# Altium schematic sheet LC79D.SchDoc
size A4; SheetNumber: 1; SheetTotal: 3
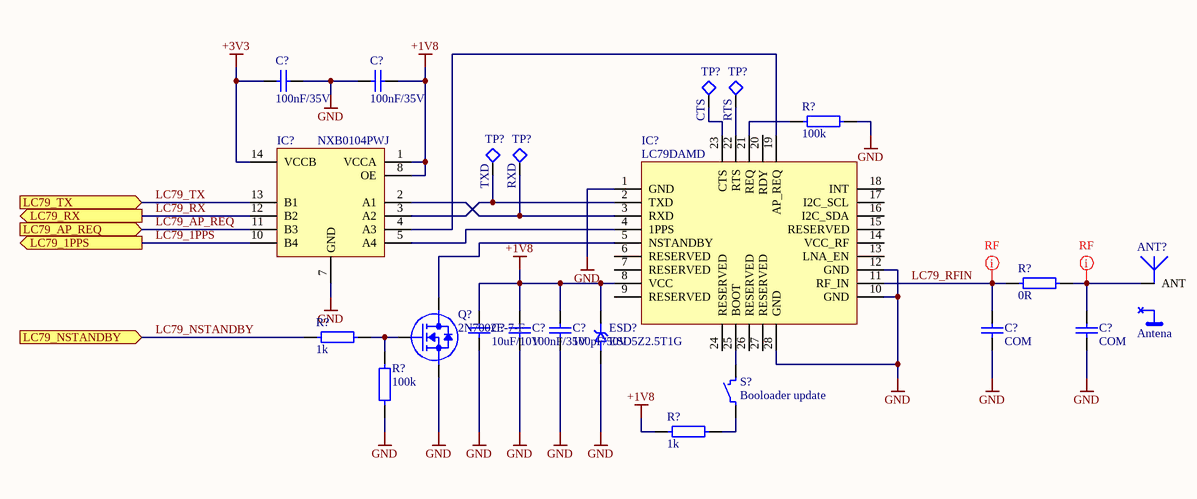
[diagram p0: LC79D.SchDoc]

## Parts
(Parts that share a designator on the sheet are numbered #1, #2 ... from top to bottom, then left to right.)
ANT?  Antena  [2116240001]
C?#1  100nF/35V  [C0603]
C?#2  100nF/35V  [C0603]
C?#3  10uF/10V  [C0603]
C?#4  100nF/35V  [C0603]
C?#5  COM  [C0603]
C?#6  COM  [C0603]
C?#7  100pF/50V  [C0603]
ESD?  ESD5Z2.5T1G  [SOD523]
IC?#1  NXB0104PWJ  [TSSOP14]
IC?#2  LC79DAMD  [GPS1010-28P]
Q?  2N7002E-7-F  [SOT23-3]
R?#1  100k  [R0603]
R?#2  0R  [R0603]
R?#3  1k  [R0603]
R?#4  100k  [R0603]
R?#5  1k  [R0603]
S?  Booloader update  [PTS636SMT]
TP?#1  CTS  [TP_SMD_S0.5]  (no BOM)
TP?#2  RTS  [TP_SMD_S0.5]  (no BOM)
TP?#3  TXD  [TP_SMD_S0.5]  (no BOM)
TP?#4  RXD  [TP_SMD_S0.5]  (no BOM)

## Ports
LC79_1PPS (out), LC79_AP_REQ (in), LC79_NSTANDBY (in), LC79_RX (out), LC79_TX (in)

## Nets
+1V8: C?#2.1 C?#3.2 C?#4.2 C?#7.2 ESD?.K IC?#1.1(VCCA) IC?#1.8(OE) IC?#2.8(VCC) R?#5.1
+3V3: C?#1.2 IC?#1.14(VCCB)
GND: C?#1.1 C?#2.2 C?#3.1 C?#4.1 C?#5.1 C?#6.1 C?#7.1 ESD?.A IC?#1.7(GND) IC?#2.1(GND) IC?#2.10(GND) IC?#2.12(GND) IC?#2.28(GND) Q?.2(S) R?#1.1 R?#4.1
LC79_1PPS: IC?#1.10(B4) ; port LC79_1PPS
LC79_AP_REQ: IC?#1.11(B3) ; port LC79_AP_REQ
LC79_NSTANDBY: R?#3.1 ; port LC79_NSTANDBY
LC79_RFIN: C?#5.2 IC?#2.11(RF_IN) R?#2.1
LC79_RX: IC?#1.12(B2) ; port LC79_RX
LC79_TX: IC?#1.13(B1) ; port LC79_TX
NetANT?_1: ANT?.1(ANT) C?#6.2 R?#2.2
NetIC?#1_2: IC?#1.2(A1) IC?#2.3(RXD) TP?#4.1
NetIC?#1_3: IC?#1.3(A2) IC?#2.2(TXD) TP?#3.1
NetIC?#1_4: IC?#1.4(A3) IC?#2.19(AP_REQ)
NetIC?#1_5: IC?#1.5(A4) IC?#2.4(1PPS)
NetIC?#2_5: IC?#2.5(NSTANDBY) Q?.3(D)
NetIC?#2_21: IC?#2.21(REQ) R?#1.2
NetIC?#2_22: IC?#2.22(RTS) TP?#2.1
NetIC?#2_23: IC?#2.23(CTS) TP?#1.1
NetIC?#2_25: IC?#2.25(BOOT) S?.2
NetQ?_1: Q?.1(G) R?#3.2 R?#4.2
NetR?#5_2: R?#5.2 S?.1

Not connected (* = marked no-connect by the designer): IC?#2 6(RESERVED) 7(RESERVED) 9(RESERVED) 13(LNA_EN) 14(VCC_RF) 15(RESERVED) 16(I2C_SDA) 17(I2C_SCL) 18(INT) 20(RDY) 24(RESERVED) 26(RESERVED) 27(RESERVED)

## Layout directives
net class RF: LC79_RFIN, NetANT?_1

## Library data of the parts
C?#1 C?#2 C?#4 = 06035G104ZAT2A: CERAMIC CAPACITOR, 0.1UF, 50V, Y5V, +80,-20%, 0603, FULL REEL; Product Range:-; Capacitance:0.1 F; Capacitance Tolerance:+80%, -20%; Dielectric Characteristic:Y5V; Voltage Rating:50V; Ceramic Capacitor Case:0603 [1608 Metric] ;RoHS Compliant: Yes; Manufacturer: Kyocera AVX; Capacitance: 100nF; Tolerance: 80%; Supplier 1: Farnell; Supplier Part Number 1: 2332660; Manufacturer Part Number: 06035G104ZAT2A; RoHS: Yes; Category: Ceramic Capacitors; Stock 1: 29140; Pricing 1: 10=0,03250, 100=0,02120, 500=0,01780, 1000=0,01420, 2000=0,01220 (GBP); Mount: Surface Mount,PCB; Case/Package: 0603; Number of Pins: 2; Case Code (Metric): 1608; Case Code (Imperial): 0603; Contact Plating: Tin,Matte; Dielectric Material: Ceramic; Min Operating Temperature: -30°C; Max Operating Temperature: 85°C; Dielectric: Y5V; Packaging: Tape and Reel; Voltage Rating (DC): 50V; Voltage Rating: 50V; Package Quantity: 1; Termination: SMD/SMT; Voltage: 50V; Series: -; Construction: Flat; Length: 1.6mm; Width: 0.032inch; Height: 0.63mm; Depth: 0.81mm; Thickness: 0.035inch; Radiation Hardening: No; REACH SVHC: No SVHC; Lead Free: Lead Free; RoHS Compliant: Yes; ComponentLink1URL: https://datasheet.ciiva.com/2987/cy5v-2987860.pdf?src-supplier=Avnet; ComponentLink1Description: https://datasheet.ciiva.com/2987/cy5v-2987860.pdf?src-supplier=Avnet; ComponentLink2URL: https://datasheet.ciiva.com/16359/cy5v-16359895.pdf?src-supplier=Future+Electronics; ComponentLink2Description: https://datasheet.ciiva.com/16359/cy5v-16359895.pdf?src-supplier=Future+Electronics; ComponentLink3URL: https://datasheet.ciiva.com/28613/578190-28613048.pdf?src-supplier=Element14; ComponentLink3Description: https://datasheet.ciiva.com/28613/578190-28613048.pdf?src-supplier=Element14; ComponentLink4URL: https://datasheet.ciiva.com/151/cy5v-151545.pdf?src-supplier=Digi-Key; ComponentLink4Description: https://datasheet.ciiva.com/151/cy5v-151545.pdf?src-supplier=Digi-Key; ComponentLink5URL: https://datasheet.ciiva.com/151/cy5v-151546.pdf?src-supplier=Digi-Key; ComponentLink5Description: https://datasheet.ciiva.com/151/cy5v-151546.pdf?src-supplier=Digi-Key; ComponentLink6URL: https://datasheet.ciiva.com/151/cy5v-151547.pdf?src-supplier=Digi-Key; ComponentLink6Description: https://datasheet.ciiva.com/151/cy5v-151547.pdf?src-supplier=Digi-Key; ComponentLink7URL: https://datasheet.ciiva.com/11499/cy5v-11499710.pdf?src-supplier=Avnet; ComponentLink7Description: https://datasheet.ciiva.com/11499/cy5v-11499710.pdf?src-supplier=Avnet; Supplier 2: Mouser; Supplier Part Number 2: 581-06035G104Z; Stock 2: 97036; Pricing 2: 1=0,09000, 10=0,03300, 50=0,03300, 100=0,02700, 1000=0,01600, 10000=0,01000 (USD); Supplier 3: Digi-Key; Supplier Part Number 3: 478-3724-6-ND; Stock 3: 629269; Pricing 3: 1=0,10000, 10=0,05900, 50=0,03220, 100=0,02640, 500=0,01882, 1000=0,01479 (USD)
C?#3 = LMK107BBJ106MALT: TAIYO YUDEN - LMK107BBJ106MALT - CAPACITOR, MLCC, X5R, 10UF, 10V, 0603, REEL, FULL REEL; Tolerance: 20%; Supplier 1: Farnell; Supplier Part Number 1: 2113070; Manufacturer: Taiyo Yuden; Manufacturer Part Number: LMK107BBJ106MALT; RoHS: Yes; Category: Ceramic Capacitors; Stock 1: 9135; Pricing 1: 10=0,08050, 100=0,04970, 500=0,03510, 1000=0,03060, 2000=0,02970, 4000=0,02430, 20000=0,01840 (GBP); Mount: Surface Mount; Case/Package: 0603; Case Code (Imperial): 0603; Case Code (Metric): 1608; Min Operating Temperature: -55°C; Max Operating Temperature: 85°C; Termination: SMD/SMT; Resistor Type: Ceramic; Package Quantity: 1; Voltage Rating: 10V; Voltage Rating (DC): 10V; Packaging: Tape and Reel; Capacitance: 10uF; Dielectric: X5R; Voltage: 10V; Length: 1.6mm; Width: 0.8mm; Height: 0.8mm; Thickness: 0.035inch; Depth: 0.8mm; Radiation Hardening: No; REACH SVHC: Unknown; Lead Free: Lead Free; ComponentLink1URL: https://datasheet.ciiva.com/11596/lmk107bbj106malt-ss-11596989.pdf?src-supplier=Avnet; ComponentLink1Description: https://datasheet.ciiva.com/11596/lmk107bbj106malt-ss-11596989.pdf?src-supplier=Avnet; ComponentLink2URL: https://datasheet.ciiva.com/26872/getdatasheetpartid-637524-26872634.pdf?src-supplier=Verical; ComponentLink2Description: https://datasheet.ciiva.com/26872/getdatasheetpartid-637524-26872634.pdf?src-supplier=Verical
C?#5 C?#6 = Capacitor
C?#7 = C1608C0G1H101J080AA: TDK   C1608C0G1H101J080AA   Multilayer Ceramic Capacitor, C Series, 100 pF,  5%, C0G / NP0, 50 V, 0603 [1608 Metric]; Capacitance: 100pF; Voltage Rating: 50V; Temperature Coefficient: 30ppm/°C; Manufacturer: TDK; Manufacturer Part Number: C1608C0G1H101J080AA; RoHS: Yes; Category: Ceramic Capacitors; Stock 1: 174097; Pricing 1: 1=0,12000, 10=0,08600, 50=0,04900, 100=0,04050, 500=0,02842, 1000=0,02352 (USD); Mount: Surface Mount; Case/Package: 0603; Number of Pins: 2; Case Code (Imperial): 0603; Case Code (Metric): 1608; Dielectric Material: Ceramic; Weight: 7.1E-05oz; Min Operating Temperature: -55°C; Max Operating Temperature: 125°C; Tolerance: 5%; Dielectric: C0G; Packaging: Tape and Reel; Voltage Rating (DC): 50V; Package Quantity: 1; Termination: SMD/SMT; Series: C; Construction: Flat; Voltage: 50V; Length: 1.6mm; Width: 0.031inch; Height: 0.8mm; Depth: 0.8mm; Thickness: 0.037inch; Radiation Hardening: No; REACH SVHC: No SVHC; Lead Free: Lead Free; RoHS Compliant: Yes; ComponentLink1URL: https://datasheet.ciiva.com/16373/e412-c-16373064.pdf?src-supplier=Future+Electronics; ComponentLink1Description: https://datasheet.ciiva.com/16373/e412-c-16373064.pdf?src-supplier=Future+Electronics; ComponentLink2URL: https://datasheet.ciiva.com/22749/1744655-22749592.pdf?src-supplier=Element14; ComponentLink2Description: https://datasheet.ciiva.com/22749/1744655-22749592.pdf?src-supplier=Element14; ComponentLink3URL: https://datasheet.ciiva.com/6293/tdkmlcccaprange-6293978.pdf?src-supplier=Digi-Key; ComponentLink3Description: https://datasheet.ciiva.com/6293/tdkmlcccaprange-6293978.pdf?src-supplier=Digi-Key; ComponentLink4URL: https://datasheet.ciiva.com/6293/tdkmlcccaprange-6293981.pdf?src-supplier=Digi-Key; ComponentLink4Description: https://datasheet.ciiva.com/6293/tdkmlcccaprange-6293981.pdf?src-supplier=Digi-Key; ComponentLink5URL: https://datasheet.ciiva.com/6293/tdkmlcccaprange-6293980.pdf?src-supplier=Digi-Key; ComponentLink5Description: https://datasheet.ciiva.com/6293/tdkmlcccaprange-6293980.pdf?src-supplier=Digi-Key; ComponentLink6URL: https://datasheet.ciiva.com/17487/e412-c-17487439.pdf?src-supplier=Avnet+Europe; ComponentLink6Description: https://datasheet.ciiva.com/17487/e412-c-17487439.pdf?src-supplier=Avnet+Europe; ComponentLink7URL: https://datasheet.ciiva.com/22694/1796654-22694095.pdf?src-supplier=Element14; ComponentLink7Description: https://datasheet.ciiva.com/22694/1796654-22694095.pdf?src-supplier=Element14; Supplier 1: Digi-Key; Supplier 2: Mouser; Supplier 3: Farnell; Supplier Part Number 1: 445-1281-6-ND; Supplier Part Number 2: 810-C1608C0G1H101J; Supplier Part Number 3: 1907297
ESD? = ESD5Z2.5T1G: ESD Suppressors / TVS Diodes 2.5V ESD Protection Unidirectional, SOD-523; Manufacturer: ON Semiconductor; Clamping Voltage: 10.9V; Number of Channels: 1; Max Surge Current: 11A; Breakdown Voltage: 4V; Peak Pulse Power: 120W; Power Line Protection: No; ESD Protection: Yes; Max Reverse Leakage Current: 6uA; Test Current: 1mA; Element Configuration: Single; Diode Type: ZENER; Capacitance: 145pF; Supplier 1: Digi-Key; Manufacturer Part Number: ESD5Z2.5T1G; RoHS: Yes; Category: ESD and Circuit Protection ICs; Stock 1: 393; Pricing 1: 1=0,20000, 10=0,18500, 100=0,10080, 500=0,06204, 1000=0,04229 (USD); Case/Package: SOD-523-2; Number of Pins: 2; Contact Plating: Tin,Matte; Min Operating Temperature: -55°C; Max Operating Temperature: 150°C; Direction: Unidirectional; Packaging: Tape and Reel; Operating Supply Voltage: 2.5V; Polarity: Unidirectional; Termination: SMD/SMT; Working Voltage: 2.5V; Series: Automotive, AEC-Q101; Package Quantity: 1; Number of Unidirectional Channels: 1; Reverse Standoff Voltage: 2.5V; Min Breakdown Voltage: 4V; Leakage Current: 6uA; Number of Lines: 1; Peak Pulse Current: 11A; Resistor Type: Zener; Clamping Voltage-Max: 10.9V; Max Breakdown Voltage: 4V; Length: 1.2mm; Width: 0.9mm; Height: 0.7mm; Depth: 0.8mm; Radiation Hardening: No; RoHS Compliant: Yes; REACH SVHC: No SVHC; Lead Free: Lead Free; Halogen Free: Halogen Free; ComponentLink1URL: https://datasheet.ciiva.com/11195/esd5z2-5t1-d-11195328.pdf?src-supplier=Avnet; ComponentLink1Description: https://datasheet.ciiva.com/11195/esd5z2-5t1-d-11195328.pdf?src-supplier=Avnet; ComponentLink2URL: https://datasheet.ciiva.com/25958/esd5z2-5t1-d-25958593.pdf?src-supplier=Avnet+Europe; ComponentLink2Description: https://datasheet.ciiva.com/25958/esd5z2-5t1-d-25958593.pdf?src-supplier=Avnet+Europe; ComponentLink3URL: https://datasheet.ciiva.com/30478/0900766b8125092b-30478675.pdf?src-supplier=RSComponents; ComponentLink3Description: https://datasheet.ciiva.com/30478/0900766b8125092b-30478675.pdf?src-supplier=RSComponents; ComponentLink4URL: https://datasheet.ciiva.com/15143/getdatasheetpartid-171817-15143870.pdf?src-supplier=Verical; ComponentLink4Description: https://datasheet.ciiva.com/15143/getdatasheetpartid-171817-15143870.pdf?src-supplier=Verical; ComponentLink5URL: https://datasheet.ciiva.com/7973/esd5z2-5t1-d-7973845.pdf?src-supplier=Element14; ComponentLink5Description: https://datasheet.ciiva.com/7973/esd5z2-5t1-d-7973845.pdf?src-supplier=Element14; ComponentLink6URL: https://datasheet.ciiva.com/3304/esd5z2-5t1-d-3304007.pdf?src-supplier=Avnet; ComponentLink6Description: https://datasheet.ciiva.com/3304/esd5z2-5t1-d-3304007.pdf?src-supplier=Avnet; ComponentLink7URL: https://datasheet.ciiva.com/339/esd5z2-5t1-d-339757.pdf?src-supplier=Digi-Key; ComponentLink7Description: https://datasheet.ciiva.com/339/esd5z2-5t1-d-339757.pdf?src-supplier=Digi-Key; ComponentLink8URL: https://datasheet.ciiva.com/339/esd5z2-5t1-d-339758.pdf?src-supplier=Digi-Key; ComponentLink8Description: https://datasheet.ciiva.com/339/esd5z2-5t1-d-339758.pdf?src-supplier=Digi-Key; ComponentLink9URL: https://datasheet.ciiva.com/339/esd5z2-5t1-d-339759.pdf?src-supplier=Digi-Key; ComponentLink9Description: https://datasheet.ciiva.com/339/esd5z2-5t1-d-339759.pdf?src-supplier=Digi-Key; Supplier 2: Mouser; Supplier 3: Farnell; Supplier 4: TME; Supplier Part Number 1: ESD5Z2.5T1GOSCT-ND; Supplier Part Number 2: 863-ESD5Z2.5T1G; Supplier Part Number 3: 2533137; Supplier Part Number 4: ESD5Z2.5T1G
IC?#1 = NXB0104PWJ: 4-bit Voltage Level Translator, Bidirectional, 100Mbps TSSOP14; Manufacturer: Nexperia; Supplier 1: Digi-Key; Manufacturer Part Number: NXB0104PWJ; RoHS: No; Stock 1: 4654; Pricing 1: 1=0,69000, 10=0,60400, 25=0,56800, 100=0,46340, 250=0,43044, 500=0,36634, 1000=0,29307 (USD); Supplier 2: Mouser; Supplier 3: Farnell; Supplier Part Number 1: 1727-NXB0104PWJCT-ND; Supplier Part Number 2: 771-NXB0104PWJ; Supplier Part Number 3: 3267988
IC?#2 = LC79DAMD: BeiDou, Galileo, GLONASS, GPS, GNSS Transceiver Module, Dual band L1+L5; Manufacturer: Quectel Wireless Solutions; Manufacturer Part Number: LC79DAMD; RoHS: No; Stock 1: 493; Pricing 1: 1=11,67000, 10=10,50000, 50=10,20000, 100=10,20000, 1000=10,20000, 10000=10,20000 (USD); Pricing 2: 1=18,48000, 10=16,72000, 25=15,40000, 100=14,08000, 250=13,20000 (USD); Supplier 1: Mouser; Supplier 2: Digi-Key; Supplier Part Number 1: 277-LC79DAMD; Supplier Part Number 2: 2958-LC79DAMDCT-ND
Q? = 2N7002E-7-F: MOSFET N-Channel; Manufacturer: Diodes; Continuous Drain Current (ID): 250mA; Rds On Max: 3R; Input Capacitance: 50pF; Drain to Source Voltage (Vdss): 60V; Max Power Dissipation: 370mW; Turn-Off Delay Time: 11ns; Turn-On Delay Time: 7ns; Gate to Source Voltage (Vgs): 20V; Drain to Source Resistance: 4R; Power Dissipation: 540mW; Number of Elements: 1; Element Configuration: Single; Manufacturer Part Number: 2N7002E-7-F; RoHS: Yes; Category: MOSFETs; Stock 1: 1805; Pricing 1: 5=0,03360, 25=0,03050, 100=0,02730, 250=0,02520, 500=0,02210, 1000=0,01680 (GBP); Mount: Surface Mount; Case/Package: SOT-23-3; Number of Pins: 3; Weight: 0.000282oz; Min Operating Temperature: -55°C; Max Operating Temperature: 150°C; Packaging: Tape and Reel; Package Quantity: 1; Drain to Source Breakdown Voltage: 60V; Number of Channels: 1; On-State Resistance: 4R; Polarity: N-CHANNEL; Series: -; Drain-source On Resistance-Max: 4R; Length: 2.9mm; Width: 1.3mm; Height: 1mm; Radiation Hardening: No; Lead Free: Lead Free; REACH SVHC: No SVHC; RoHS Compliant: Yes; ComponentLink1URL: https://datasheet.ciiva.com/4443/ds30376-87503-4443073.pdf?src-supplier=Mouser; ComponentLink1Description: https://datasheet.ciiva.com/4443/ds30376-87503-4443073.pdf?src-supplier=Mouser; ComponentLink2URL: https://datasheet.ciiva.com/16305/ds30376-16305448.pdf?src-supplier=Future+Electronics; ComponentLink2Description: https://datasheet.ciiva.com/16305/ds30376-16305448.pdf?src-supplier=Future+Electronics; ComponentLink3URL: https://datasheet.ciiva.com/11174/ds30376-11174910.pdf?src-supplier=Avnet; ComponentLink3Description: https://datasheet.ciiva.com/11174/ds30376-11174910.pdf?src-supplier=Avnet; ComponentLink4URL: https://datasheet.ciiva.com/6371/ds30376-6371036.pdf?src-supplier=Digi-Key; ComponentLink4Description: https://datasheet.ciiva.com/6371/ds30376-6371036.pdf?src-supplier=Digi-Key; ComponentLink5URL: https://datasheet.ciiva.com/6371/ds30376-6371039.pdf?src-supplier=Digi-Key; ComponentLink5Description: https://datasheet.ciiva.com/6371/ds30376-6371039.pdf?src-supplier=Digi-Key; Stock 2: 8667; Pricing 2: 1=0,27000, 10=0,18100, 50=0,18100, 100=0,08700, 1000=0,05100, 10000=0,03400 (USD); Stock 3: 35005; Pricing 3: 1=0,29000, 10=0,19800, 25=0,18720, 100=0,09680, 500=0,08074, 1000=0,05610 (USD); Stock 4: 10690; Pricing 4: 10=0,06870, 100=0,05240, 300=0,04940, 1000=0,04640, 5000=0,04510, 10000=0,04450, 10=0,06680, 100=0,05100, 300=0,04810, 1000=0,04520, 5000=0,04390, 10000=0,04330, 10=0,34300, 100=0,26180, 300=0,24690, 1000=0,23190, 5000=0,22540, 10000=0,22220, 10=0,32960, 100=0,25160, 300=0,23720, 1000=0,22280, 5000=0,21660, 10000=0,21350, 10=0,04430, 100=0,03380, 300=0,03190, 1000=0,03000, 5000=0,02910, 10000=0,02870, 10=0,03820, 100=0,02910, 300=0,02750, 1000=0,02580, 5000=0,02510, 10000=0,02470, 10=0,40990, 100=0,31290, 300=0,29500, 1000=0,27720, 5000=0,26940, 10000=0,26550, 10=5,72380, 100=4,36870, 300=4,11940, 1000=3,87010, 5000=3,76170, 10000=3,70750, 10=0,21510, 100=0,16420, 300=0,15480, 1000=0,14540, 5000=0,14140, 10000=0,13930, 10=3,92540, 100=2,99610, 300=2,82510, 1000=2,65410, 5000=2,57980, 10000=2,54260, 10=0,45030, 100=0,34370, 300=0,32410, 1000=0,30440, 5000=0,29590, 10000=0,29160, 10=0,07090, 100=0,05410, 300=0,05100, 1000=0,04790, 5000=0,04660, 10000=0,04590, 10=0,05280, 100=0,04030, 300=0,03800, 1000=0,03570, 5000=0,03470, 10000=0,03420 (AUD); Supplier 1: Farnell; Supplier Part Number 1: 3577032; Supplier 2: Mouser; Supplier Part Number 2: 621-2N7002E-7-F; Supplier 3: Digi-Key; Supplier Part Number 3: 2N7002E-FDIDKR-ND; Supplier 4: LCSC; Supplier Part Number 4: C151383; Supplier 5: Mouser; Supplier Part Number 5: 771-NX7002AKAR; Supplier 6: Farnell; Supplier Part Number 6: 3287982
R?#1 R?#4 = CR0603-FX-1003ELF: Bourns CR0603-FX Series Thick Film Surface Mount Fixed Resistor 0603 Case 100k 1% 0.1W 100ppm/C; Temperature Coefficient: 100ppm/°C; Resistance: 100kR; Voltage Rating (DC): 50V; Max Power Dissipation: 100mW; Manufacturer: Bourns; Manufacturer Part Number: CR0603-FX-1003ELF; RoHS: Yes; Category: Chip SMD Resistors; Stock 1: 282; Pricing 1: 1=0,10000, 10=0,01700, 100=0,00680, 1000=0,00305, 2500=0,00264 (USD); Mount: Surface Mount; Case/Package: 0603; Number of Pins: 2; Contact Plating: Tin; Case Code (Metric): 1608; Case Code (Imperial): 0603; Min Operating Temperature: -55°C; Max Operating Temperature: 155°C; Resistor Type: Thick Film; Tolerance: 1%; Number of Terminations: 2; Termination: SMD/SMT; Features: Moisture Resistant; Packaging: Tape and Reel; Power Rating: 100mW; Voltage Rating: 50V; Package Quantity: 1; Working Voltage: 50V; Length: 1.6mm; Width: 0.031inch; Height: 0.022inch; Depth: 0.8mm; Thickness: 457um; Radiation Hardening: No; REACH SVHC: No SVHC; Military Standard: Not; ComponentLink1URL: https://datasheet.ciiva.com/11808/0900766b80fcdb72-11808036.pdf?src-supplier=RSComponents; ComponentLink1Description: https://datasheet.ciiva.com/11808/0900766b80fcdb72-11808036.pdf?src-supplier=RSComponents; ComponentLink2URL: https://datasheet.ciiva.com/19466/1163741-19466516.pdf?src-supplier=Jameco; ComponentLink2Description: https://datasheet.ciiva.com/19466/1163741-19466516.pdf?src-supplier=Jameco; ComponentLink3URL: https://datasheet.ciiva.com/41449/001055485-da-01-en-smd-wid-cr0603-fx-1003elf-100k-ohm-1-10w-41449971.pdf?src-supplier=Conrad; ComponentLink3Description: https://datasheet.ciiva.com/41449/001055485-da-01-en-smd-wid-cr0603-fx-1003elf-100k-ohm-1-10w-41449971.pdf?src-supplier=Conrad; ComponentLink4URL: https://datasheet.ciiva.com/46385/691949-46385260.pdf?src-supplier=Element14; ComponentLink4Description: https://datasheet.ciiva.com/46385/691949-46385260.pdf?src-supplier=Element14; ComponentLink5URL: https://datasheet.ciiva.com/6547/chpreztr-6547309.pdf?src-supplier=Digi-Key; ComponentLink5Description: https://datasheet.ciiva.com/6547/chpreztr-6547309.pdf?src-supplier=Digi-Key; ComponentLink6URL: https://datasheet.ciiva.com/6547/chpreztr-6547310.pdf?src-supplier=Digi-Key; ComponentLink6Description: https://datasheet.ciiva.com/6547/chpreztr-6547310.pdf?src-supplier=Digi-Key; ComponentLink7URL: https://datasheet.ciiva.com/3255/chpreztr-3255919.pdf?src-supplier=Avnet; ComponentLink7Description: https://datasheet.ciiva.com/3255/chpreztr-3255919.pdf?src-supplier=Avnet; ComponentLink8URL: https://datasheet.ciiva.com/16782/70154685-16782911.pdf?src-supplier=Allied+Electronics; ComponentLink8Description: https://datasheet.ciiva.com/16782/70154685-16782911.pdf?src-supplier=Allied+Electronics; ComponentLink9URL: https://datasheet.ciiva.com/22693/1902866-22693207.pdf?src-supplier=Element14; ComponentLink9Description: https://datasheet.ciiva.com/22693/1902866-22693207.pdf?src-supplier=Element14; ComponentLink10URL: https://datasheet.ciiva.com/16941/chpreztr-16941643.pdf?src-supplier=Avnet+Europe; ComponentLink10Description: https://datasheet.ciiva.com/16941/chpreztr-16941643.pdf?src-supplier=Avnet+Europe; ComponentLink11URL: https://datasheet.ciiva.com/15159/getdatasheetpartid-57636-15159629.pdf?src-supplier=Verical; ComponentLink11Description: https://datasheet.ciiva.com/15159/getdatasheetpartid-57636-15159629.pdf?src-supplier=Verical; ComponentLink12URL: https://datasheet.ciiva.com/5546/chpreztr-5546894.pdf?src-supplier=Mouser; ComponentLink12Description: https://datasheet.ciiva.com/5546/chpreztr-5546894.pdf?src-supplier=Mouser; ComponentLink13URL: https://datasheet.ciiva.com/7986/1902866-7986158.pdf?src-supplier=Element14; ComponentLink13Description: https://datasheet.ciiva.com/7986/1902866-7986158.pdf?src-supplier=Element14; ComponentLink14URL: https://datasheet.ciiva.com/6547/chpreztr-6547311.pdf?src-supplier=Digi-Key; ComponentLink14Description: https://datasheet.ciiva.com/6547/chpreztr-6547311.pdf?src-supplier=Digi-Key; ComponentLink15URL: https://datasheet.ciiva.com/30120/159chpreztr-30120559.pdf?src-supplier=Onlinecomponents.com; ComponentLink15Description: https://datasheet.ciiva.com/30120/159chpreztr-30120559.pdf?src-supplier=Onlinecomponents.com; Supplier 1: Digi-Key; Supplier 2: Mouser; Supplier 3: Farnell; Supplier Part Number 1: CR0603-FX-1003ELFCT-ND; Supplier Part Number 2: 652-CR0603-FX-103ELF; Supplier Part Number 3: 2008342
R?#2 = WR06X0000FTL: Res, 0R0, 1%, 0.1W, 0603, Thick Film; Manufacturer: Walsin Technologies; Power Rating: 100mW; Voltage Rating (DC): 50V; Supplier 1: Farnell; Supplier Part Number 1: 2668260; Manufacturer Part Number: WR06X0000FTL; Category: Resistors; Stock 1: 784; Pricing 1: 10=0,00340, 100=0,00310, 500=0,00270, 1000=0,00230, 2500=0,00190 (GBP); Case/Package: 0603; Contact Material: Tin; Resistance: 0R; Tolerance: 1%; Lead Free: Lead Free; ComponentLink1URL: http://www.farnell.com/datasheets/1960319.pdf?src-supplier=Farnell; ComponentLink1Description: http://www.farnell.com/datasheets/1960319.pdf?src-supplier=Farnell; ComponentLink2URL: http://datasheet.octopart.com/WR06X0000FTL-Walsin-Technologies-datasheet-48038251.pdf?src-supplier=Element14; ComponentLink2Description: http://datasheet.octopart.com/WR06X0000FTL-Walsin-Technologies-datasheet-48038251.pdf?src-supplier=Element14; ComponentLink3URL: http://datasheet.octopart.com/WR06X0000FTL-Walsin-Technologies-datasheet-32780790.pdf; ComponentLink3Description: http://datasheet.octopart.com/WR06X0000FTL-Walsin-Technologies-datasheet-32780790.pdf
R?#3 R?#5 = CR0603-FX-1001ELF: BOURNS - CR0603-FX-1001ELF - SMD Chip Resistor, 0603 [1608 Metric], 1 kohm, CR Series, 50 V, Thick Film, 100 mW; Manufacturer Series: CR0603; Resistance: 1kR; Tolerance: 1%; Temperature Coefficient: 100ppm/°C; Power Rating: 100mW; Voltage Rating: 50V; Manufacturer: Bourns; Manufacturer Part Number: CR0603-FX-1001ELF; RoHS: Yes; Category: Chip SMD Resistors; Stock 1: 461544; Pricing 1: 1=0,10000, 10=0,01700, 100=0,00680, 1000=0,00305, 2500=0,00264 (USD); Mount: Surface Mount; Case/Package: 0603; Number of Pins: 2; Contact Plating: Tin; Case Code (Metric): 1608; Case Code (Imperial): 0603; Package Shape: Rectangular; Size Code: 0603; Terminal Finish: Tin; Min Operating Temperature: -55°C; Max Operating Temperature: 155°C; Resistor Type: Thick Film; Packaging: Tape and Reel; Package Quantity: 1; Number of Terminations: 2; Termination: SMD/SMT; Max Power Dissipation: 100mW; Voltage Rating (DC): 50V; Features: Moisture Resistant; Series: CR0603; Resistance Tolerance: 1%; Technology: THICK FILM; Construction: Rectangular; Working Voltage: 50V; Length: 1.6mm; Width: 0.8mm; Height: 0.45mm; Depth: 0.8mm; Thickness: 457um; Radiation Hardening: No; REACH SVHC: No SVHC; Military Standard: Not; RoHS Compliant: Yes; ComponentLink1URL: https://datasheet.ciiva.com/11808/0900766b80fcdb72-11808035.pdf?src-supplier=RSComponents; ComponentLink1Description: https://datasheet.ciiva.com/11808/0900766b80fcdb72-11808035.pdf?src-supplier=RSComponents; ComponentLink2URL: https://datasheet.ciiva.com/19466/774882-19466523.pdf?src-supplier=Jameco; ComponentLink2Description: https://datasheet.ciiva.com/19466/774882-19466523.pdf?src-supplier=Jameco; ComponentLink3URL: https://datasheet.ciiva.com/6547/chpreztr-6547349.pdf?src-supplier=Digi-Key; ComponentLink3Description: https://datasheet.ciiva.com/6547/chpreztr-6547349.pdf?src-supplier=Digi-Key; ComponentLink4URL: https://datasheet.ciiva.com/16941/chpreztr-16941637.pdf?src-supplier=Avnet+Europe; ComponentLink4Description: https://datasheet.ciiva.com/16941/chpreztr-16941637.pdf?src-supplier=Avnet+Europe; ComponentLink5URL: https://datasheet.ciiva.com/22693/1902866-22693205.pdf?src-supplier=Element14; ComponentLink5Description: https://datasheet.ciiva.com/22693/1902866-22693205.pdf?src-supplier=Element14; ComponentLink6URL: https://datasheet.ciiva.com/6547/chpreztr-6547350.pdf?src-supplier=Digi-Key; ComponentLink6Description: https://datasheet.ciiva.com/6547/chpreztr-6547350.pdf?src-supplier=Digi-Key; ComponentLink7URL: https://datasheet.ciiva.com/7001/1902866-7001622.pdf?src-supplier=Newark; ComponentLink7Description: https://datasheet.ciiva.com/7001/1902866-7001622.pdf?src-supplier=Newark; ComponentLink8URL: https://datasheet.ciiva.com/30115/159chpreztr-30115222.pdf?src-supplier=Onlinecomponents.com; ComponentLink8Description: https://datasheet.ciiva.com/30115/159chpreztr-30115222.pdf?src-supplier=Onlinecomponents.com; ComponentLink9URL: https://datasheet.ciiva.com/6547/chpreztr-6547351.pdf?src-supplier=Digi-Key; ComponentLink9Description: https://datasheet.ciiva.com/6547/chpreztr-6547351.pdf?src-supplier=Digi-Key; ComponentLink10URL: https://datasheet.ciiva.com/16757/70154685-16757482.pdf?src-supplier=Allied+Electronics; ComponentLink10Description: https://datasheet.ciiva.com/16757/70154685-16757482.pdf?src-supplier=Allied+Electronics; ComponentLink11URL: https://datasheet.ciiva.com/5546/chpreztr-5546283.pdf?src-supplier=Mouser; ComponentLink11Description: https://datasheet.ciiva.com/5546/chpreztr-5546283.pdf?src-supplier=Mouser; ComponentLink12URL: https://datasheet.ciiva.com/7986/691949-7986156.pdf?src-supplier=Element14; ComponentLink12Description: https://datasheet.ciiva.com/7986/691949-7986156.pdf?src-supplier=Element14; ComponentLink13URL: https://datasheet.ciiva.com/3255/chpreztr-3255917.pdf?src-supplier=Avnet; ComponentLink13Description: https://datasheet.ciiva.com/3255/chpreztr-3255917.pdf?src-supplier=Avnet; Supplier 1: Digi-Key; Supplier 2: Mouser; Supplier 3: Farnell; Supplier Part Number 1: CR0603-FX-1001ELFCT-ND; Supplier Part Number 2: 652-CR0603FX-1001ELF; Supplier Part Number 3: 2691848
S? = PTS636SP50SMTRLFS: PTS636 Series SPST-NO Off-Mom 320 gf Top Actuated Gull Wing SMT Tactile Switch; Manufacturer: ITT C&K; Supplier 1: Digi-Key; Manufacturer Part Number: PTS636SP50SMTRLFS; RoHS: No; Stock 1: 5319; Pricing 1: 1=0,120000, 10=0,112000, 25=0,106000, 100=0,096300, 250=0,090520, 500=0,082820 (USD); Supplier 2: Mouser; Supplier Part Number 1: CKN12316-1-ND; Supplier Part Number 2: 611-PTS636SP50SMTRLF
TP?#1-TP?#4 = Test PAD